# Altium schematic sheet 2_PWR.SchDoc: SHMP_MainBoard - Power Supply
size B; Author: Sébastien Gélinas; Organization: SmartHalo; Address1: 5445 de Gaspé; Address2: Montréal, QC; Address3: Canada; Address4: H2T 3B2; DocumentNumber: 1; Revision: 1; SheetNumber: 2; SheetTotal: 4
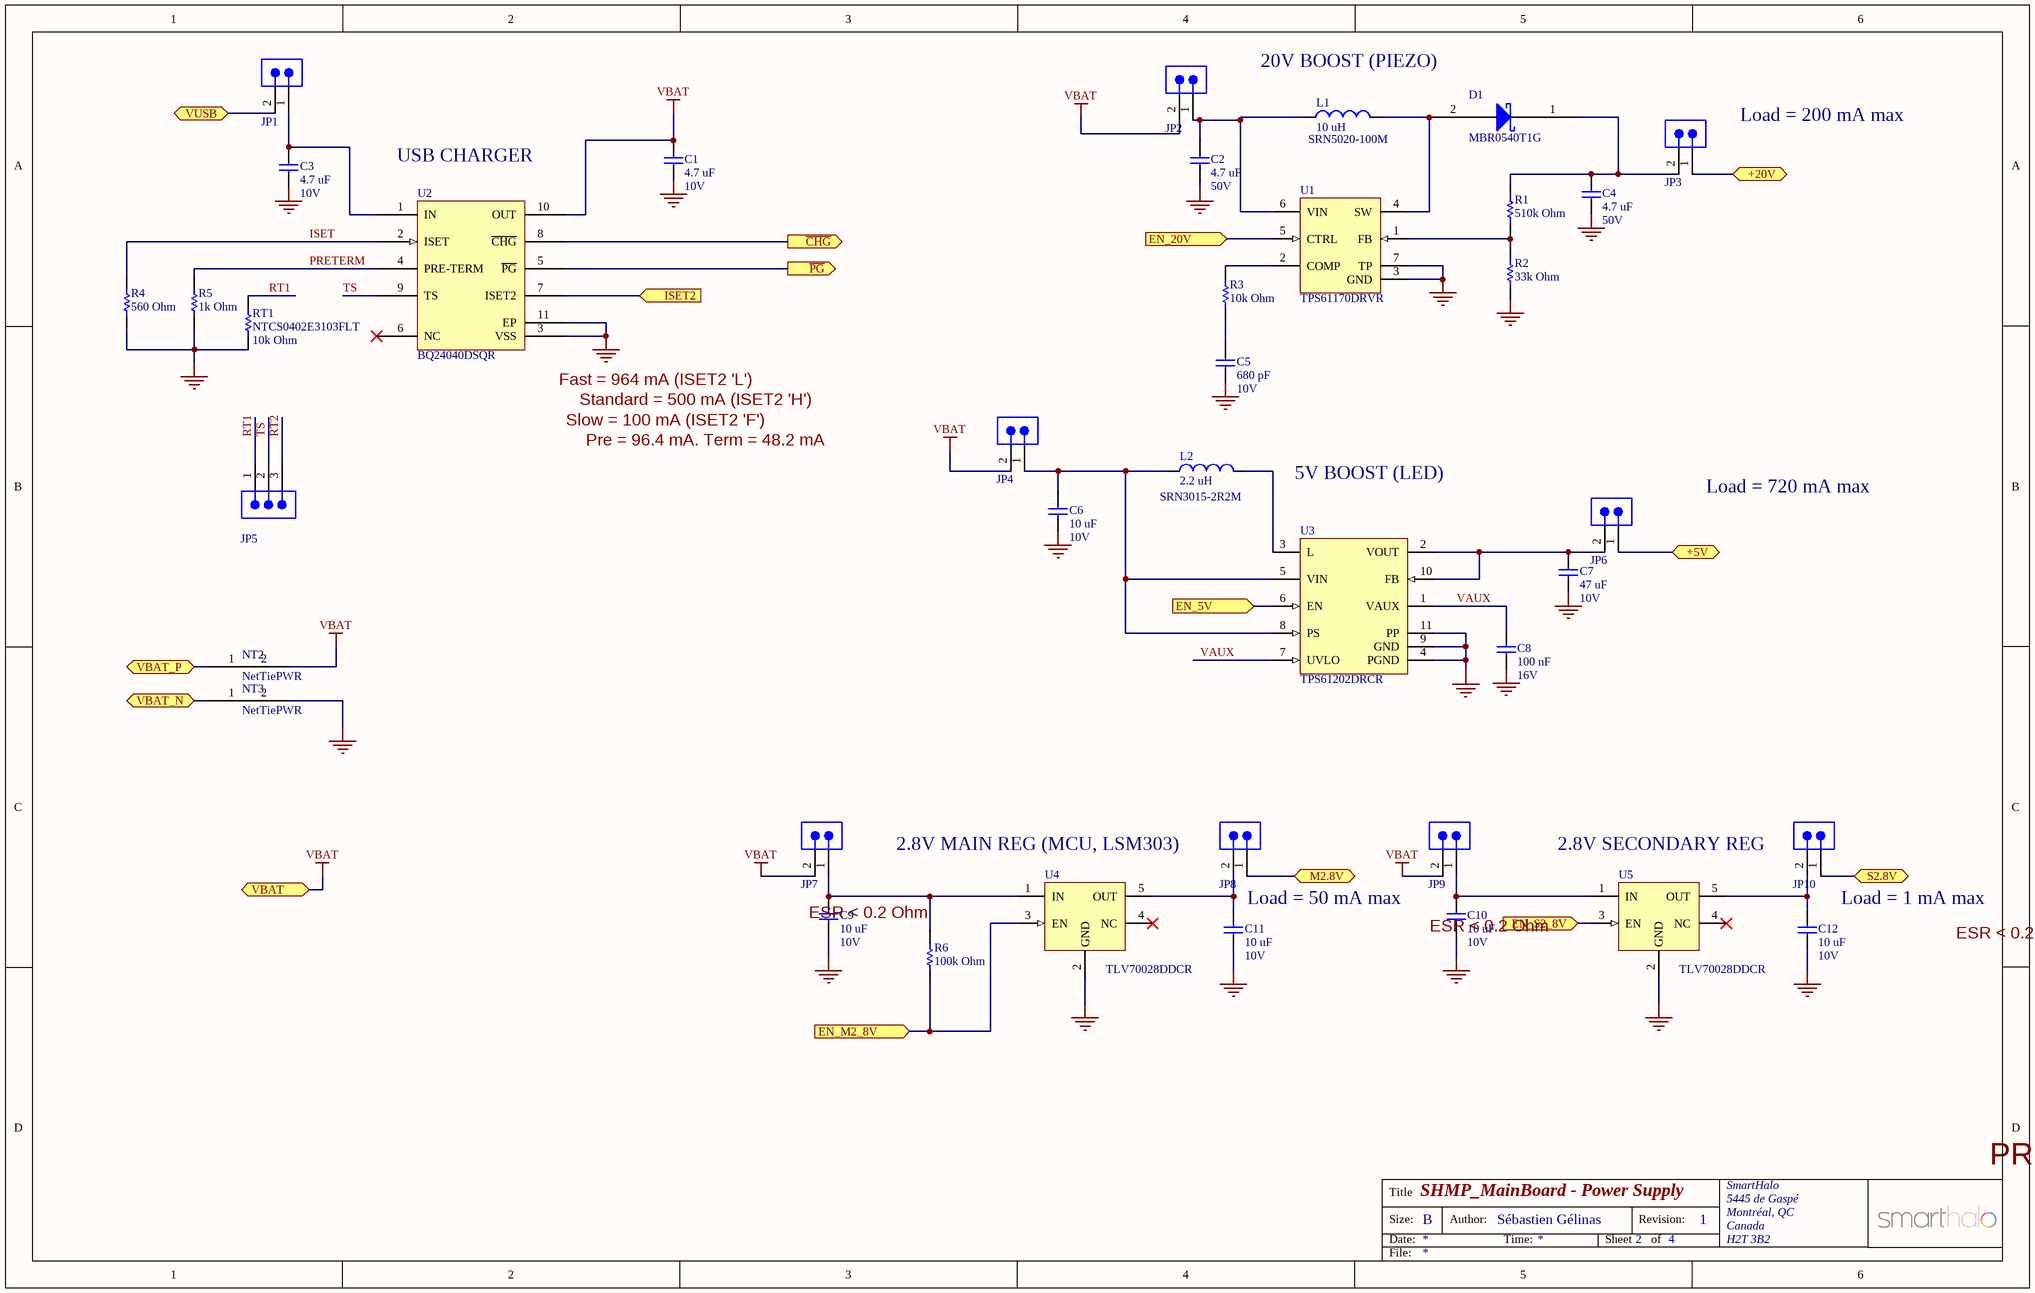
[diagram p0: 2_PWR.SchDoc]

## Parts
C1  4.7 uF  Voltage Rating: 10V  [Varitron_CAP0603]
C2  4.7 uF  Voltage Rating: 50V  [Varitron_CAP0805]
C3  4.7 uF  Voltage Rating: 10V  [Varitron_CAP0603]
C4  4.7 uF  Voltage Rating: 50V  [Varitron_CAP0805]
C5  680 pF  Voltage Rating: 10V  [Varitron_CAP0402]
C6  10 uF  Voltage Rating: 10V  [Varitron_CAP0805]
C7  47 uF  Voltage Rating: 10V  [Varitron_CAP1206]
C8  100 nF  Voltage Rating: 16V  [Varitron_CAP0402]
C9  10 uF  Voltage Rating: 10V  [Varitron_CAP0805]
C10  10 uF  Voltage Rating: 10V  [Varitron_CAP0805]
C11  10 uF  Voltage Rating: 10V  [Varitron_CAP0805]
C12  10 uF  Voltage Rating: 10V  [Varitron_CAP0805]
D1  MBR0540T1G  [ONSC-SOD-123-2-425-04_V]
JP1  JMP_2PINS_100MILS  [HDR_2X1_100MILS]  (value not drawn)  (no BOM)
JP2  JMP_2PINS_100MILS  [HDR_2X1_100MILS]  (value not drawn)  (no BOM)
JP3  JMP_2PINS_100MILS  [HDR_2X1_100MILS]  (value not drawn)  (no BOM)
JP4  JMP_2PINS_100MILS  [HDR_2X1_100MILS]  (value not drawn)  (no BOM)
JP5  JMP_3PINS_100MILS  [HDR_1X3_100MILS]  (value not drawn)  (no BOM)
JP6  JMP_2PINS_100MILS  [HDR_2X1_100MILS]  (value not drawn)  (no BOM)
JP7  JMP_2PINS_100MILS  [HDR_2X1_100MILS]  (value not drawn)  (no BOM)
JP8  JMP_2PINS_100MILS  [HDR_2X1_100MILS]  (value not drawn)  (no BOM)
JP9  JMP_2PINS_100MILS  [HDR_2X1_100MILS]  (value not drawn)  (no BOM)
JP10  JMP_2PINS_100MILS  [HDR_2X1_100MILS]  (value not drawn)  (no BOM)
L1  10 uH  [SRN5020-100M]
L2  2.2 uH  [SRN3015-2R2M]
NT2  NetTiePWR  [NetTiePWR]  (net tie, no BOM)
NT3  NetTiePWR  [NetTiePWR]  (net tie, no BOM)
R1  510k Ohm  [Varitron_RES0402]
R2  33k Ohm  [Varitron_RES0402]
R3  10k Ohm  [Varitron_RES0402]
R4  560 Ohm  [Varitron_RES0402]
R5  1k Ohm  [Varitron_RES0402]
R6  100k Ohm  [Varitron_RES0402]
RT1  NTCS0402E3103FLT  value 10k Ohm  [Varitron_RES0402]
U1  TPS61170DRVR  [DRV6-1600X1000TP]
U2  BQ24040DSQR  [DSQ10-1500X900TP]
U3  TPS61202DRCR  [DRC10-2400X1650TP]
U4  TLV70028DDCR  [SOT23-5_N]
U5  TLV70028DDCR  [SOT23-5_N]

## Ports
+5V, +20V, EN_5V (in), EN_20V (in), EN_M2_8V (in), EN_S2_8V (in), ISET2 (in), M2.8V, S2.8V, VBAT, VBAT_N, VBAT_P, VUSB, ~{CHG} (out), ~{PG} (out)

## Nets
GND: C1.2 C2.2 C3.2 C4.2 C5.2 C6.2 C7.2 C8.2 C9.2 C10.2 C11.2 C12.2 NT3.2(NET2) R2.1 R4.2 R5.2 RT1.1 U1.3(GND) U1.7(TP) U2.3(VSS) U2.11(EP) U3.4(PGND) U3.9(GND) U3.11(PP) U4.2(GND) U5.2(GND)
VBAT: C1.1 JP2.2 JP4.2 JP7.2 JP9.2 NT2.2(NET2) U2.10(OUT) ; port VBAT
+5V: JP6.1 ; port +5V
+20V: JP3.1 ; port +20V
~{CHG}: U2.8(~{CHG}) ; port ~{CHG}
EN_5V: U3.6(EN) ; port EN_5V
EN_20V: U1.5(CTRL) ; port EN_20V
EN_M2_8V: R6.1 U4.3(EN) ; port EN_M2_8V
EN_S2_8V: U5.3(EN) ; port EN_S2_8V
ISET: R4.1 U2.2(ISET)
ISET2: U2.7(ISET2) ; port ISET2
M2.8V: JP8.1 ; port M2.8V
~{PG}: U2.5(~{PG}) ; port ~{PG}
PRETERM: R5.1 U2.4(PRE-TERM)
RT1: JP5.1 RT1.2
RT2: JP5.3
S2.8V: JP10.1 ; port S2.8V
TS: JP5.2 U2.9(TS)
VAUX: C8.1 U3.1(VAUX) U3.7(UVLO)
VBAT_N: NT3.1(NET1) ; port VBAT_N
VBAT_P: NT2.1(NET1) ; port VBAT_P
VUSB: JP1.2 ; port VUSB
NetC2_1: C2.1 JP2.1 L1.1 U1.6(VIN)
NetC3_1: C3.1 JP1.1 U2.1(IN)
NetC4_1: C4.1 D1.1(Cathode) JP3.2 R1.2
NetC5_1: C5.1 R3.2
NetC6_1: C6.1 JP4.1 L2.1 U3.5(VIN) U3.8(PS)
NetC7_1: C7.1 JP6.2 U3.2(VOUT) U3.10(FB)
NetC9_1: C9.1 JP7.1 R6.2 U4.1(IN)
NetC10_1: C10.1 JP9.1 U5.1(IN)
NetC11_1: C11.1 JP8.2 U4.5(OUT)
NetC12_1: C12.1 JP10.2 U5.5(OUT)
NetD1_2: D1.2(Anode) L1.2 U1.4(SW)
NetL2_2: L2.2 U3.3(L)
NetR1_1: R1.1 R2.2 U1.1(FB)
NetR3_1: R3.1 U1.2(COMP)

Not connected (* = marked no-connect by the designer): U2 6(NC)*; U4 4(NC)*; U5 4(NC)*

## Notes on the sheet
- 20V BOOST (PIEZO)
- (near U2) USB CHARGER
- (near JP3) Load = 200 mA max
- (near U2) Fast = 964 mA (ISET2 'L')
- Slow = 100 mA (ISET2 'F')
- Standard = 500 mA (ISET2 'H')
- Pre = 96.4 mA. Term = 48.2 mA
- 5V BOOST (LED)
- Load = 720 mA max
- (near U4) 2.8V MAIN REG (MCU, LSM303)
- (near C11) Load = 50 mA max
- (near U5) 2.8V SECONDARY REG
- Load = 1 mA max
- (near C9) ESR < 0.2 Ohm
- (near C10) ESR < 0.2 Ohm
- (near C12) ESR < 0.2 Ohm
- PRELIMINARY: DO NOT USE FOR PRODUCTION
- Title
- Size:
- Date:
- B
- Author:
- Time:
- Sheet
- Revision:
- of
- File:

## Library data of the parts
C1 C3 = Varitron_CAP0603: 4.7 uF 10V X7R 10% 0603 (1608 Metric)  SMD; Case-EIA: 0603; Case-Metric: 1608; Tolerance: 10%; Technology: SMT; Temperature Coefficient: X7R; Value: 4.7 uF; Supplier: Arrow Electronics; Footprint Name: 0603
C2 C4 = Varitron_CAP0805: 4.7 uF 50V X5R 10% 0805 (2012 Metric)  SMD; Case-EIA: 0805; Case-Metric: 2012; Tolerance: 10%; Technology: SMT; Temperature Coefficient: X5R; Value: 4.7 uF; Supplier: Arrow Electronics; Footprint Name: 0805
C5 = Varitron_CAP0402: 680 pF 10V X7R 10% 0402 (1005 Metric)  SMD; Case-EIA: 0402; Case-Metric: 1005; Tolerance: 10%; Technology: SMT; Temperature Coefficient: X7R; Value: 680 pF; Supplier: Arrow Electronics; Footprint Name: 0402
C6 C9-C12 = Varitron_CAP0805: 10 uF 10V X7R 10% 0805 (2012 Metric)  SMD; Case-EIA: 0805; Case-Metric: 2012; Tolerance: 10%; Technology: SMT; Temperature Coefficient: X7R; Value: 10 uF; Supplier: Arrow Electronics; Footprint Name: 0805
C7 = Varitron_CAP1206: 47 uF 10V X5R 10% 1206 (3216 Metric)  SMD; Case-EIA: 1206; Case-Metric: 3216; Tolerance: 10%; Technology: SMT; Temperature Coefficient: X5R; Value: 47 uF; Supplier: Arrow Electronics; Footprint Name: 1206
C8 = Varitron_CAP0402: 100 nF 16V X7R 10% 0402 (1005 Metric)  SMD; Case-EIA: 0402; Case-Metric: 1005; Tolerance: 10%; Technology: SMT; Temperature Coefficient: X7R; Value: 100 nF; Supplier: Arrow Electronics; Footprint Name: 0402
D1 = MBR0540T1G: Schottky Power Rectifier, 2-Pin SOD-123, Pb-Free, Tape and Reel; Manufacturer: ON Semiconductor; Manufacturer Part Number: MBR0540T1G; Part Number: MBR0540T1G; Supplier: Arrow Electronics; Footprint Name: SOD123
JP1-JP4 JP6-JP10 = JMP_2PINS_100MILS: Jumper, 100 mils, 2 pins
JP5 = JMP_3PINS_100MILS: Jumper, 100 mils, 3 pins
L1 = SRN5020-100M: Inductor, 10 uH, 20%, 144 mOhm DCR, 1.3A; Manufacturer: Bourns; Manufacturer Part Number: SRN5020-100M; Part Number: SRN5020-100M; Value: 10 uH; Tolerance: 20%; DCR: 144 mOhm; Saturation Current: 1.3A; Supplier: Arrow Electronics; Footprint Name: IND5020
L2 = SRN3015-2R2M: Inductor, 2.2 uH, 20%, 72 mOhm DCR, 1.65A; Manufacturer: Bourns; DCR: 72 mOhm; Manufacturer Part Number: SRN3015-2R2M; Part Number: SRN3015-2R2M; Value: 2.2 uH; Tolerance: 20%; Saturation Current: 1.65A; Supplier: Arrow Electronics; Footprint Name: IND3015
R1 = Varitron_RES0402: 510k 0.063W 5%  0402 (1005 Metric)  SMD; Case-Metric: 1005; Case-EIA: 0402; Tolerance: 5%; Technology: SMT; Power: 0.063W; Value: 510k Ohm; Supplier: Arrow Electronics; Footprint Name: 0402
R2 = Varitron_RES0402: 33k 0.063W 5%  0402 (1005 Metric)  SMD; Case-Metric: 1005; Case-EIA: 0402; Tolerance: 5%; Technology: SMT; Power: 0.063W; Value: 33k Ohm; Supplier: Arrow Electronics; Footprint Name: 0402
R3 = Varitron_RES0402: 10k 0.063W 5%  0402 (1005 Metric)  SMD; Case-Metric: 1005; Case-EIA: 0402; Tolerance: 5%; Technology: SMT; Power: 0.063W; Value: 10k Ohm; Supplier: Arrow Electronics; Footprint Name: 0402
R4 = Varitron_RES0402: 560R 0.063W 5%  0402 (1005 Metric)  SMD; Case-Metric: 1005; Case-EIA: 0402; Tolerance: 5%; Technology: SMT; Power: 0.063W; Value: 560 Ohm; Supplier: Arrow Electronics; Footprint Name: 0402
R5 = Varitron_RES0402: 1k 0.063W 5%  0402 (1005 Metric)  SMD; Case-Metric: 1005; Case-EIA: 0402; Tolerance: 5%; Technology: SMT; Power: 0.063W; Value: 1k Ohm; Supplier: Arrow Electronics; Footprint Name: 0402
R6 = Varitron_RES0402: 100k 0.063W 5%  0402 (1005 Metric)  SMD; Case-Metric: 1005; Case-EIA: 0402; Tolerance: 5%; Technology: SMT; Power: 0.063W; Supplier: Arrow Electronics; Footprint Name: 0402; Value: 100k Ohm
RT1 = NTCS0402E3103FLT: Thermistor NTC 0402, R0 10k, 1%, B 3490, SMD; Manufacturer: Vishay; Case-Metric: 1005; Case-EIA: 0402; Beta: 3490; Tolerance: 1%; Technology: SMT; Part Number: NTCS0402E3103FLT; Manufacturer Part Number: NTCS0402E3103FLT; Supplier: Arrow Electronics; Footprint Name: 0402
U1 = TPS61170DRVR: Boost Voltage Converter with 3 to 18 V Input and 3 to 38 V Output, -40 to 85 degC, 6-Pin SON (DRC), Green (RoHS & no Sb/Br); Manufacturer: Texas Instruments; Part Number: TPS61170DRVR; Manufacturer Part Number: TPS61170DRVR; Supplier: Arrow Electronics; Footprint Name: SON6
U2 = BQ24040DSQR: 800 mA, Single-Input, Single Cell Li-Ion Battery Charger with Auto Start. Vovp=6.6 V, 3.5 V, -40 to 85 degC, 10-pin SON (DSQ), Green (RoHS & no Sb/Br); Manufacturer: Texas Instruments; Manufacturer Part Number: BQ24040DSQR; Part Number: BQ24040DSQR; Supplier: Arrow Electronics; Footprint Name: WSON10
U3 = TPS61202DRCR: Boost Voltage Converter with 0.3 to 5.5 V Input and 5 V Output, -40 to 85 degC, 10-Pin SON (DRC), Green (RoHS & no Sb/Br); Manufacturer: Texas Instruments; Part Number: TPS61202DRCR; Manufacturer Part Number: TPS61202DRCR; Supplier: Arrow Electronics; Footprint Name: SON10
U4 U5 = TLV70028DDCR: 200 mA Low Dropout Regulator, 2 - 5.5V Input, Fixed 2.8V Output; Manufacturer: Texas Instruments; Part Number: TLV70028DDCR; Manufacturer Part Number: TLV70028DDCR; Supplier: Arrow Electronics; Footprint Name: SOT23-5